# Altium schematic sheet PG02_Full_Bridge.SchDoc
size A3
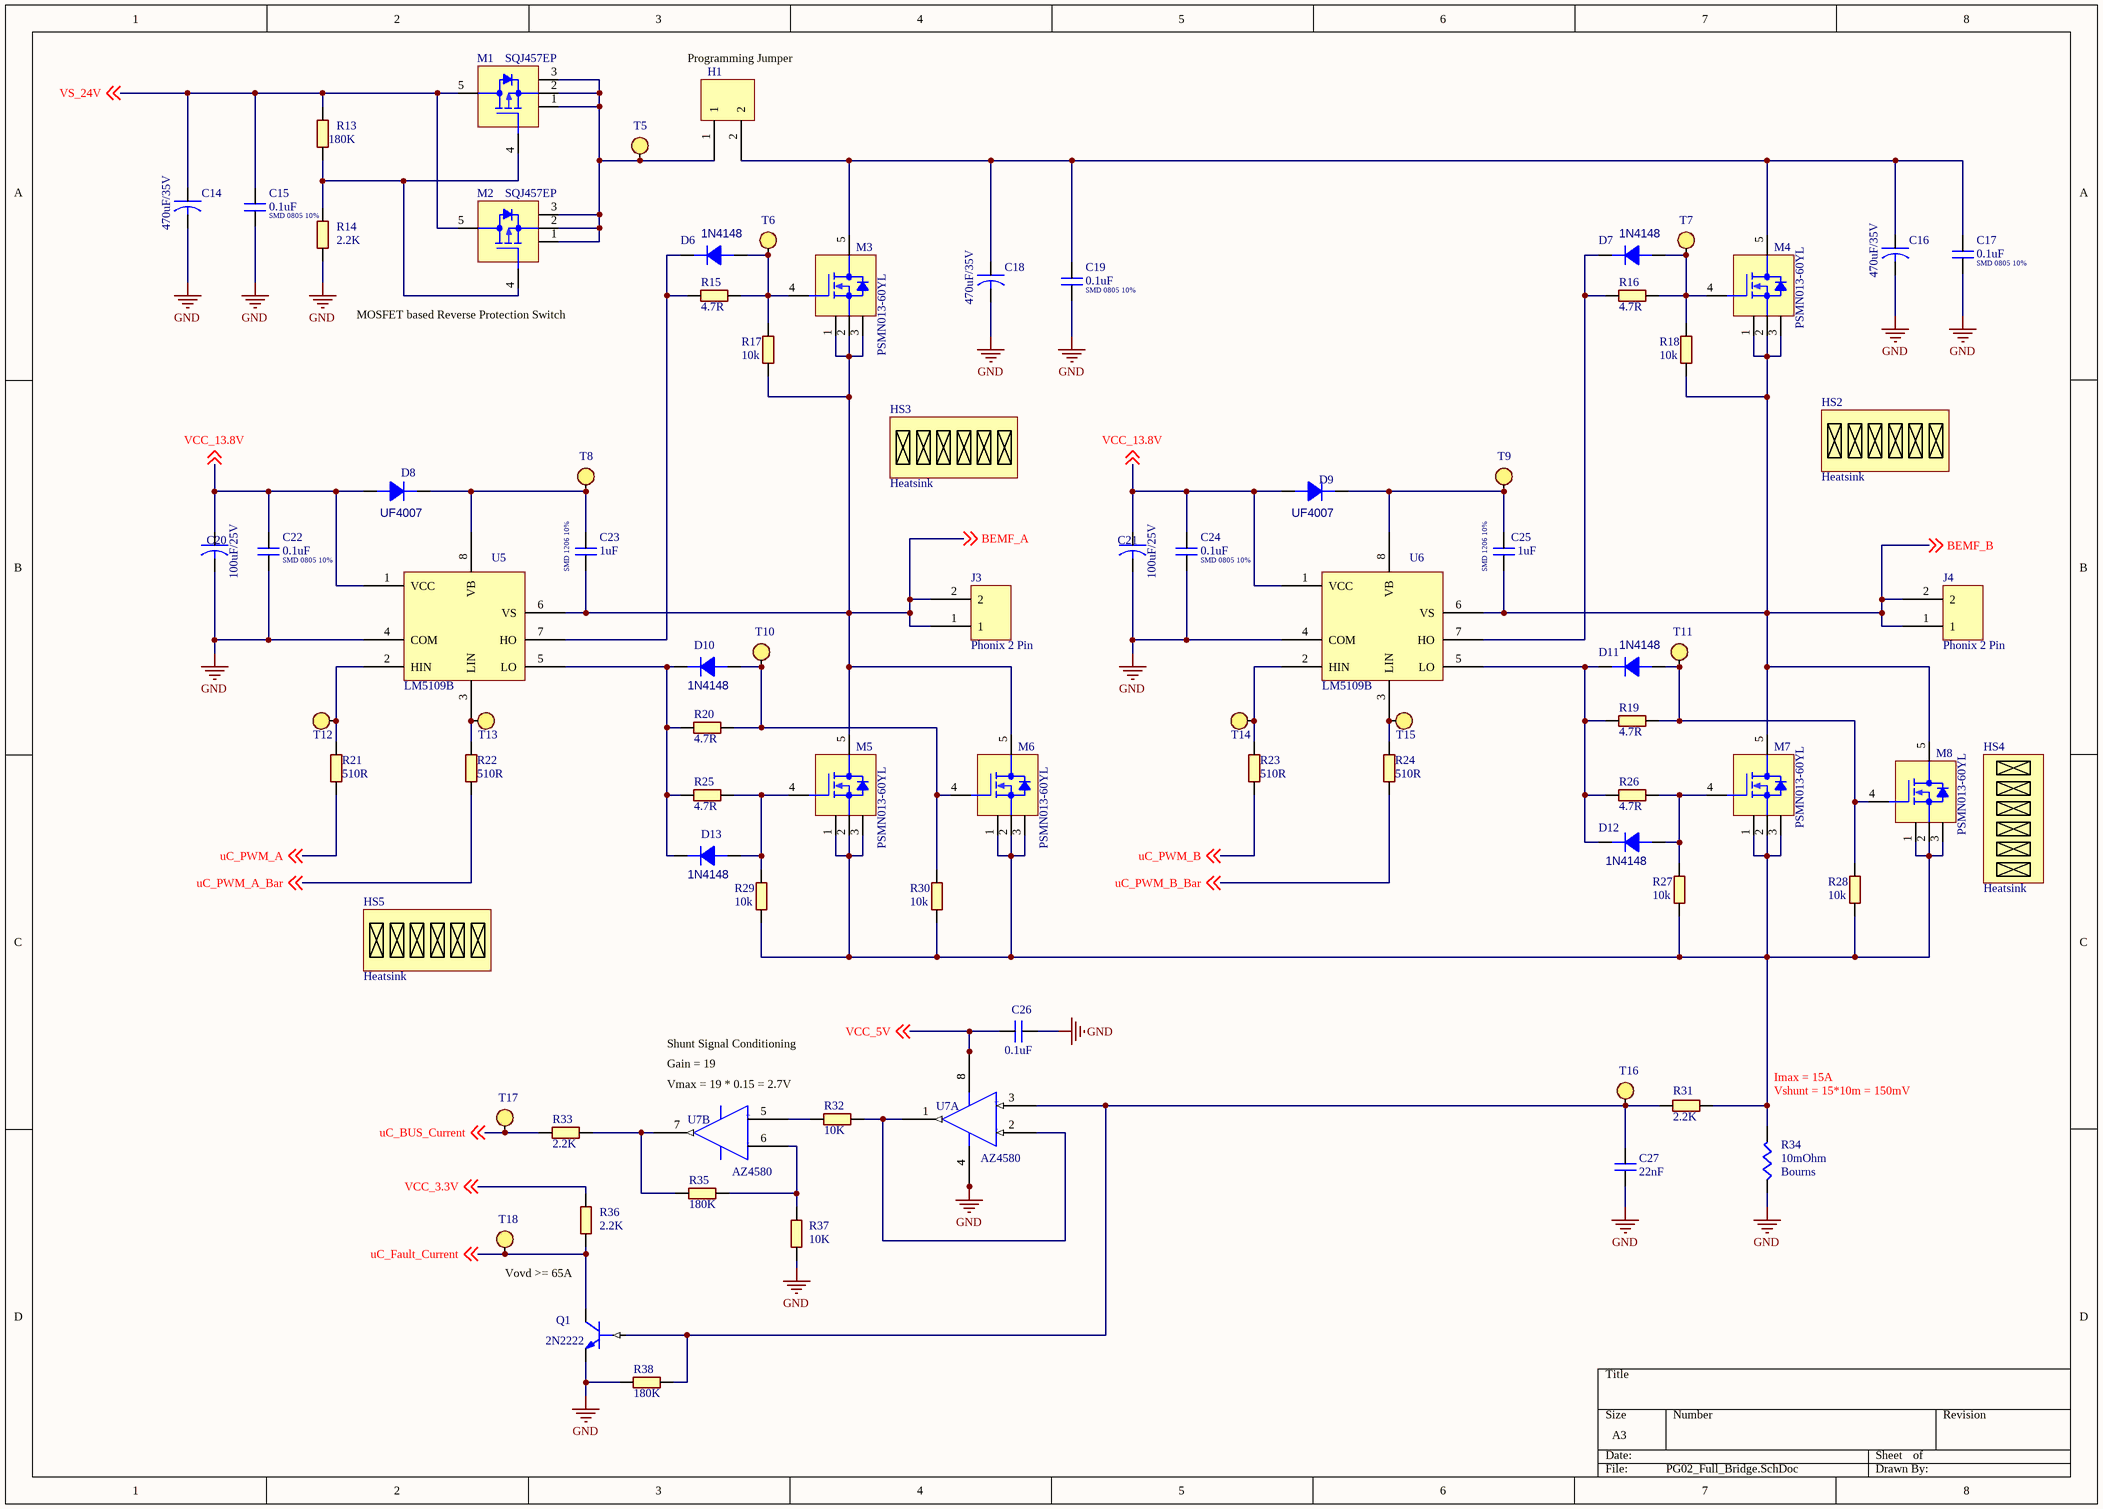
[diagram p0: PG02_Full_Bridge.SchDoc]

## Parts
C14  value 470uF/35V  [CAP 10MM DIA]  (hidden comment: Electrolyte Cap)
C15  SMD 0805 10%  value 0.1uF  [SMD0805]
C16  value 470uF/35V  [CAP 10MM DIA]  (hidden comment: Electrolyte Cap)
C17  SMD 0805 10%  value 0.1uF  [SMD0805]
C18  value 470uF/35V  [CAP 10MM DIA]  (hidden comment: Electrolyte Cap)
C19  SMD 0805 10%  value 0.1uF  [SMD0805]
C20  100uF/25V  [CAP 5MM]
C21  100uF/25V  [CAP 5MM]
C22  SMD 0805 10%  value 0.1uF  [SMD0805]
C23  SMD 1206 10%  value 1uF  [SMD1206]
C24  SMD 0805 10%  value 0.1uF  [SMD0805]
C25  SMD 1206 10%  value 1uF  [SMD1206]
C26  value 0.1uF  [SMD0805]  (hidden comment: SMD 0805 10%)
C27  value 22nF  [SMD0805]  (hidden comment: SMD 0805 10%)
D6  1N4148  [SOD-80]
D7  1N4148  [SOD-80]
D8  UF4007  [DO-214(SMA)]
D9  UF4007  [DO-214(SMA)]
D10  1N4148  [SOD-80]
D11  1N4148  [SOD-80]
D12  1N4148  [SOD-80]
D13  1N4148  [SOD-80]
H1  Header 2 pin  [Header-2-Pin]  (value not drawn)
HS2  Heatsink  [Heatsink_25mm]
HS3  Heatsink  [Heatsink_25mm]
HS4  Heatsink  [Heatsink_25mm]
HS5  Heatsink  [Heatsink_25mm]
J3  Phonix 2 Pin  [PHONIX2]
J4  Phonix 2 Pin  [PHONIX2]
M1  value SQJ457EP  [SO8-L]  (hidden comment: P MOSFET)
M2  value SQJ457EP  [SO8-L]  (hidden comment: P MOSFET)
M3  value PSMN013-60YL  [SO8-L]  (hidden comment: N MOSFET)
M4  value PSMN013-60YL  [SO8-L]  (hidden comment: N MOSFET)
M5  value PSMN013-60YL  [SO8-L]  (hidden comment: N MOSFET)
M6  value PSMN013-60YL  [SO8-L]  (hidden comment: N MOSFET)
M7  value PSMN013-60YL  [SO8-L]  (hidden comment: N MOSFET)
M8  value PSMN013-60YL  [SO8-L]  (hidden comment: N MOSFET)
Q1  value 2N2222  [SOT23-3-Leads]  (hidden comment: NPN Transistor)
R13  value 180K  [SMD1206]  (hidden comment: SMD 1206 1%)
R14  value 2.2K  [SMD1206]  (hidden comment: SMD 1206 1%)
R15  value 4.7R  [SMD1206]  (hidden comment: SMD 1206 1%)
R16  value 4.7R  [SMD1206]  (hidden comment: SMD 1206 1%)
R17  value 10k  [SMD1206]  (hidden comment: SMD 1206 1%)
R18  value 10k  [SMD1206]  (hidden comment: SMD 1206 1%)
R19  value 4.7R  [SMD1206]  (hidden comment: SMD 1206 1%)
R20  value 4.7R  [SMD1206]  (hidden comment: SMD 1206 1%)
R21  value 510R  [SMD1206]  (hidden comment: SMD 1206 1%)
R22  value 510R  [SMD1206]  (hidden comment: SMD 1206 1%)
R23  value 510R  [SMD1206]  (hidden comment: SMD 1206 1%)
R24  value 510R  [SMD1206]  (hidden comment: SMD 1206 1%)
R25  value 4.7R  [SMD1206]  (hidden comment: SMD 1206 1%)
R26  value 4.7R  [SMD1206]  (hidden comment: SMD 1206 1%)
R27  value 10k  [SMD1206]  (hidden comment: SMD 1206 1%)
R28  value 10k  [SMD1206]  (hidden comment: SMD 1206 1%)
R29  value 10k  [SMD1206]  (hidden comment: SMD 1206 1%)
R30  value 10k  [SMD1206]  (hidden comment: SMD 1206 1%)
R31  value 2.2K  [SMD1206]  (hidden comment: SMD 1206 1%)
R32  value 10K  [SMD1206]  (hidden comment: SMD 1206 1%)
R33  value 2.2K  [SMD1206]  (hidden comment: SMD 1206 1%)
R34  value 10mOhm  Manufacturer: Bourns  [SMD2512]  (hidden comment: CRA2512)
R35  value 180K  [SMD1206]  (hidden comment: SMD 1206 1%)
R36  value 2.2K  [SMD1206]  (hidden comment: SMD 1206 1%)
R37  value 10K  [SMD1206]  (hidden comment: SMD 1206 1%)
R38  value 180K  [SMD1206]  (hidden comment: SMD 1206 1%)
T5  Through hole TestPoint  [TP]  (value not drawn)
T6  Through hole TestPoint  [TP]  (value not drawn)
T7  Through hole TestPoint  [TP]  (value not drawn)
T8  Through hole TestPoint  [TP]  (value not drawn)
T9  Through hole TestPoint  [TP]  (value not drawn)
T10  Through hole TestPoint  [TP]  (value not drawn)
T11  Through hole TestPoint  [TP]  (value not drawn)
T12  Through hole TestPoint  [TP]  (value not drawn)
T13  Through hole TestPoint  [TP]  (value not drawn)
T14  Through hole TestPoint  [TP]  (value not drawn)
T15  Through hole TestPoint  [TP]  (value not drawn)
T16  Through hole TestPoint  [TP]  (value not drawn)
T17  Through hole TestPoint  [TP]  (value not drawn)
T18  Through hole TestPoint  [TP]  (value not drawn)
U5  LM5109B  [SOIC-8]
U6  LM5109B  [SOIC-8]
U7  value AZ4580  [SOIC-8]  (hidden comment: LM358)  (parts A,B of 2)

## Nets
GND: C14.2 C15.2 C16.2 C17.2 C18.2 C19.2 C20.2 C21.2 C22.2 C24.2 C26.2 C27.2 Q1.2(EMITTER) R14.2 R34.1 R37.1 R38.1 U5.4(COM) U6.4(COM) U7.4(GND)
BEMF_A: C23.2 J3.1 J3.2 M3.1 M3.2 M3.3 M5.5 M6.5 R17.1 U5.6(VS) ; off-sheet BEMF_A
BEMF_B: C25.2 J4.1 J4.2 M4.1 M4.2 M4.3 M7.5 M8.5 R18.1 U6.6(VS) ; off-sheet BEMF_B
uC_BUS_Current: R33.1 T17.1 ; off-sheet uC_BUS_Current
uC_Fault_Current: Q1.3(COLLECTOR) R36.1 T18.1 ; off-sheet uC_Fault_Current
uC_PWM_A: R21.2 ; off-sheet uC_PWM_A
uC_PWM_A_Bar: R22.2 ; off-sheet uC_PWM_A_Bar
uC_PWM_B: R23.2 ; off-sheet uC_PWM_B
uC_PWM_B_Bar: R24.2 ; off-sheet uC_PWM_B_Bar
VCC_3.3V: R36.2 ; off-sheet VCC_3.3V
VCC_5V: C26.1 U7.8(VCC) ; off-sheet VCC_5V
VCC_13.8V: C20.1 C21.1 C22.1 C24.1 D8.1(ANODE) D9.1(ANODE) U5.1(VCC) U6.1(VCC) ; off-sheet VCC_13.8V
VS_24V: C14.1 C15.1 M1.5 M2.5 R13.1 ; off-sheet VS_24V
NetC16_1: C16.1 C17.1 C18.1 C19.1 H1.2 M3.5 M4.5
NetC23_1: C23.1 D8.2(CATHODE) T8.1 U5.8(VB)
NetC25_1: C25.1 D9.2(CATHODE) T9.1 U6.8(VB)
NetC27_1: C27.1 Q1.1(BASE) R31.1 R38.2 T16.1 U7.3(+IN)
NetD6_1: D6.1(ANODE) M3.4(G) R15.1 R17.2 T6.1
NetD6_2: D6.2(CATHODE) R15.2 U5.7(HO)
NetD7_1: D7.1(ANODE) M4.4(G) R16.1 R18.2 T7.1
NetD7_2: D7.2(CATHODE) R16.2 U6.7(HO)
NetD10_1: D10.1(ANODE) M6.4(G) R20.2 R30.2 T10.1
NetD10_2: D10.2(CATHODE) D13.2(CATHODE) R20.1 R25.2 U5.5(LO)
NetD11_1: D11.1(ANODE) M8.4(G) R19.1 R28.2 T11.1
NetD11_2: D11.2(CATHODE) D12.2(CATHODE) R19.2 R26.2 U6.5(LO)
NetD12_1: D12.1(ANODE) M7.4(G) R26.1 R27.2
NetD13_1: D13.1(ANODE) M5.4(G) R25.1 R29.2
NetH1_1: H1.1 M1.1 M1.2 M1.3 M2.1 M2.2 M2.3 T5.1
NetM1_4: M1.4(G) M2.4(G) R13.2 R14.1
NetM5_1: M5.1 M5.2 M5.3 M6.1 M6.2 M6.3 M7.1 M7.2 M7.3 M8.1 M8.2 M8.3 R27.1 R28.1 R29.1 R30.1 R31.2 R34.2
NetR21_1: R21.1 T12.1 U5.2(HIN)
NetR22_1: R22.1 T13.1 U5.3(LIN)
NetR23_1: R23.1 T14.1 U6.2(HIN)
NetR24_1: R24.1 T15.1 U6.3(LIN)
NetR32_1: R32.1 U7.5(+IN)
NetR32_2: R32.2 U7.1(OUT) U7.2(-IN)
NetR33_2: R33.2 R35.1 U7.7(OUT)
NetR35_2: R35.2 R37.2 U7.6(-IN)

## Notes on the sheet
- Programming Jumper
- (near M2) MOSFET based Reverse Protection Switch
- Shunt Signal Conditioning
- (near U7) Gain = 19
- Vmax = 19 * 0.15 = 2.7V
- Imax = 15A
- (near R34) Vshunt = 15*10m = 150mV
- (near T18) Vovd >= 65A
- (in symbol LM358, part A) +; -
- (in symbol LM358, part B) +; -

## Library data of the parts
C14 C16 C18 C20 C21 = CAP
C15 C17 C19 C22-C27 = CAP_SMD: Manufacturer: Vishay
D6-D13 = 1N4148: Part No.: SM4007; Manufacturer: Vishay; Source Of Supply: Rajiv Electronics,Pune; Type: Component; Temp. Range: -65 to 150 Deg. Cel.; Tolerance: 10%; Rating: -; Temp. Coeff.: -; Termination: -; Marking: -; Category: Diode
H1 = Header_2_Pin: Manufaturer: Rajeev; Value: 2 pin Relimate Male Header
HS2-HS5 = HS_15W: Value: Heatsink
J3 J4 = Phonix_2_Pin
M1 M2 = PMOS_SQJ457EP: Manufacturer: Vishay
M3-M8 = MOS_PSMN013-60YL: Manufacturer: NxP
Q1 = 2N3904_1: Manufacturer: OnSemi
R13-R33 R35-R38 = RES_SMD: Manufacturer: Vishay; Description: SMD1206  1% Resistor
R34 = RES_TH
T5-T18 = TestPoint_TH: Value: TP
U5 U6 = IR2106
U7 = LM358: Manufacturer: ST Semiconductor